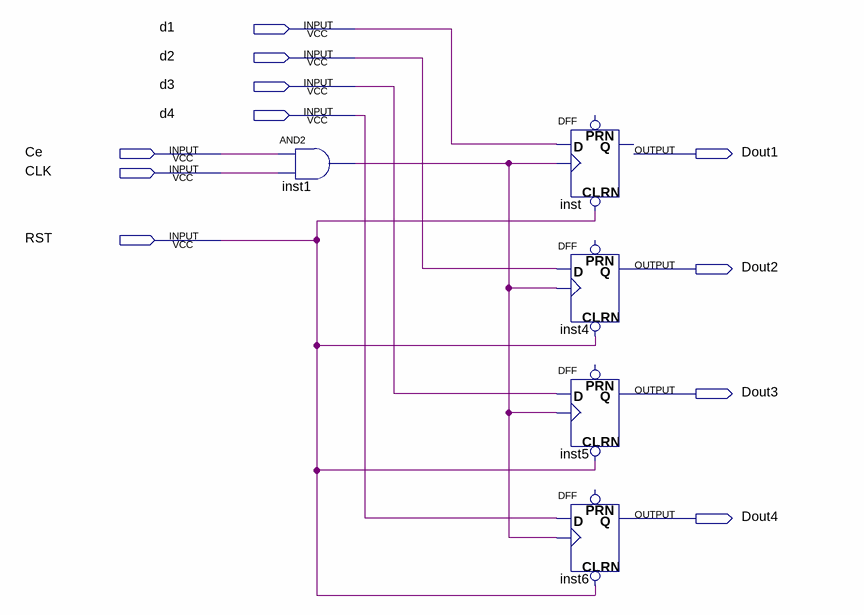
[diagram p0: schematic sheet]
// Quartus schematic Block4.bdf as structural Verilog: 5 symbols, 11 pins
module Block4 (
  input  d1,
  input  d2,
  input  d3,
  input  d4,
  input  Ce,
  input  CLK,
  input  RST,
  output Dout1,
  output Dout2,
  output Dout3,
  output Dout4
);

  wire inst1_out;

  and inst1 (inst1_out, Ce, CLK);
  DFF inst (.CLRN(RST), .CLK(inst1_out), .D(d1));  // open: PRN, Q
  DFF inst4 (.CLRN(RST), .CLK(inst1_out), .D(d2), .Q(Dout2));  // open: PRN
  DFF inst5 (.CLRN(RST), .CLK(inst1_out), .D(d3), .Q(Dout3));  // open: PRN
  DFF inst6 (.CLRN(RST), .CLK(inst1_out), .D(d4), .Q(Dout4));  // open: PRN
endmodule
